# Altium schematic sheet hierarchy.SchDoc
size A3; DocumentNumber: 1; SheetNumber: 1; SheetTotal: 24; SheetDescription: Structure of Master
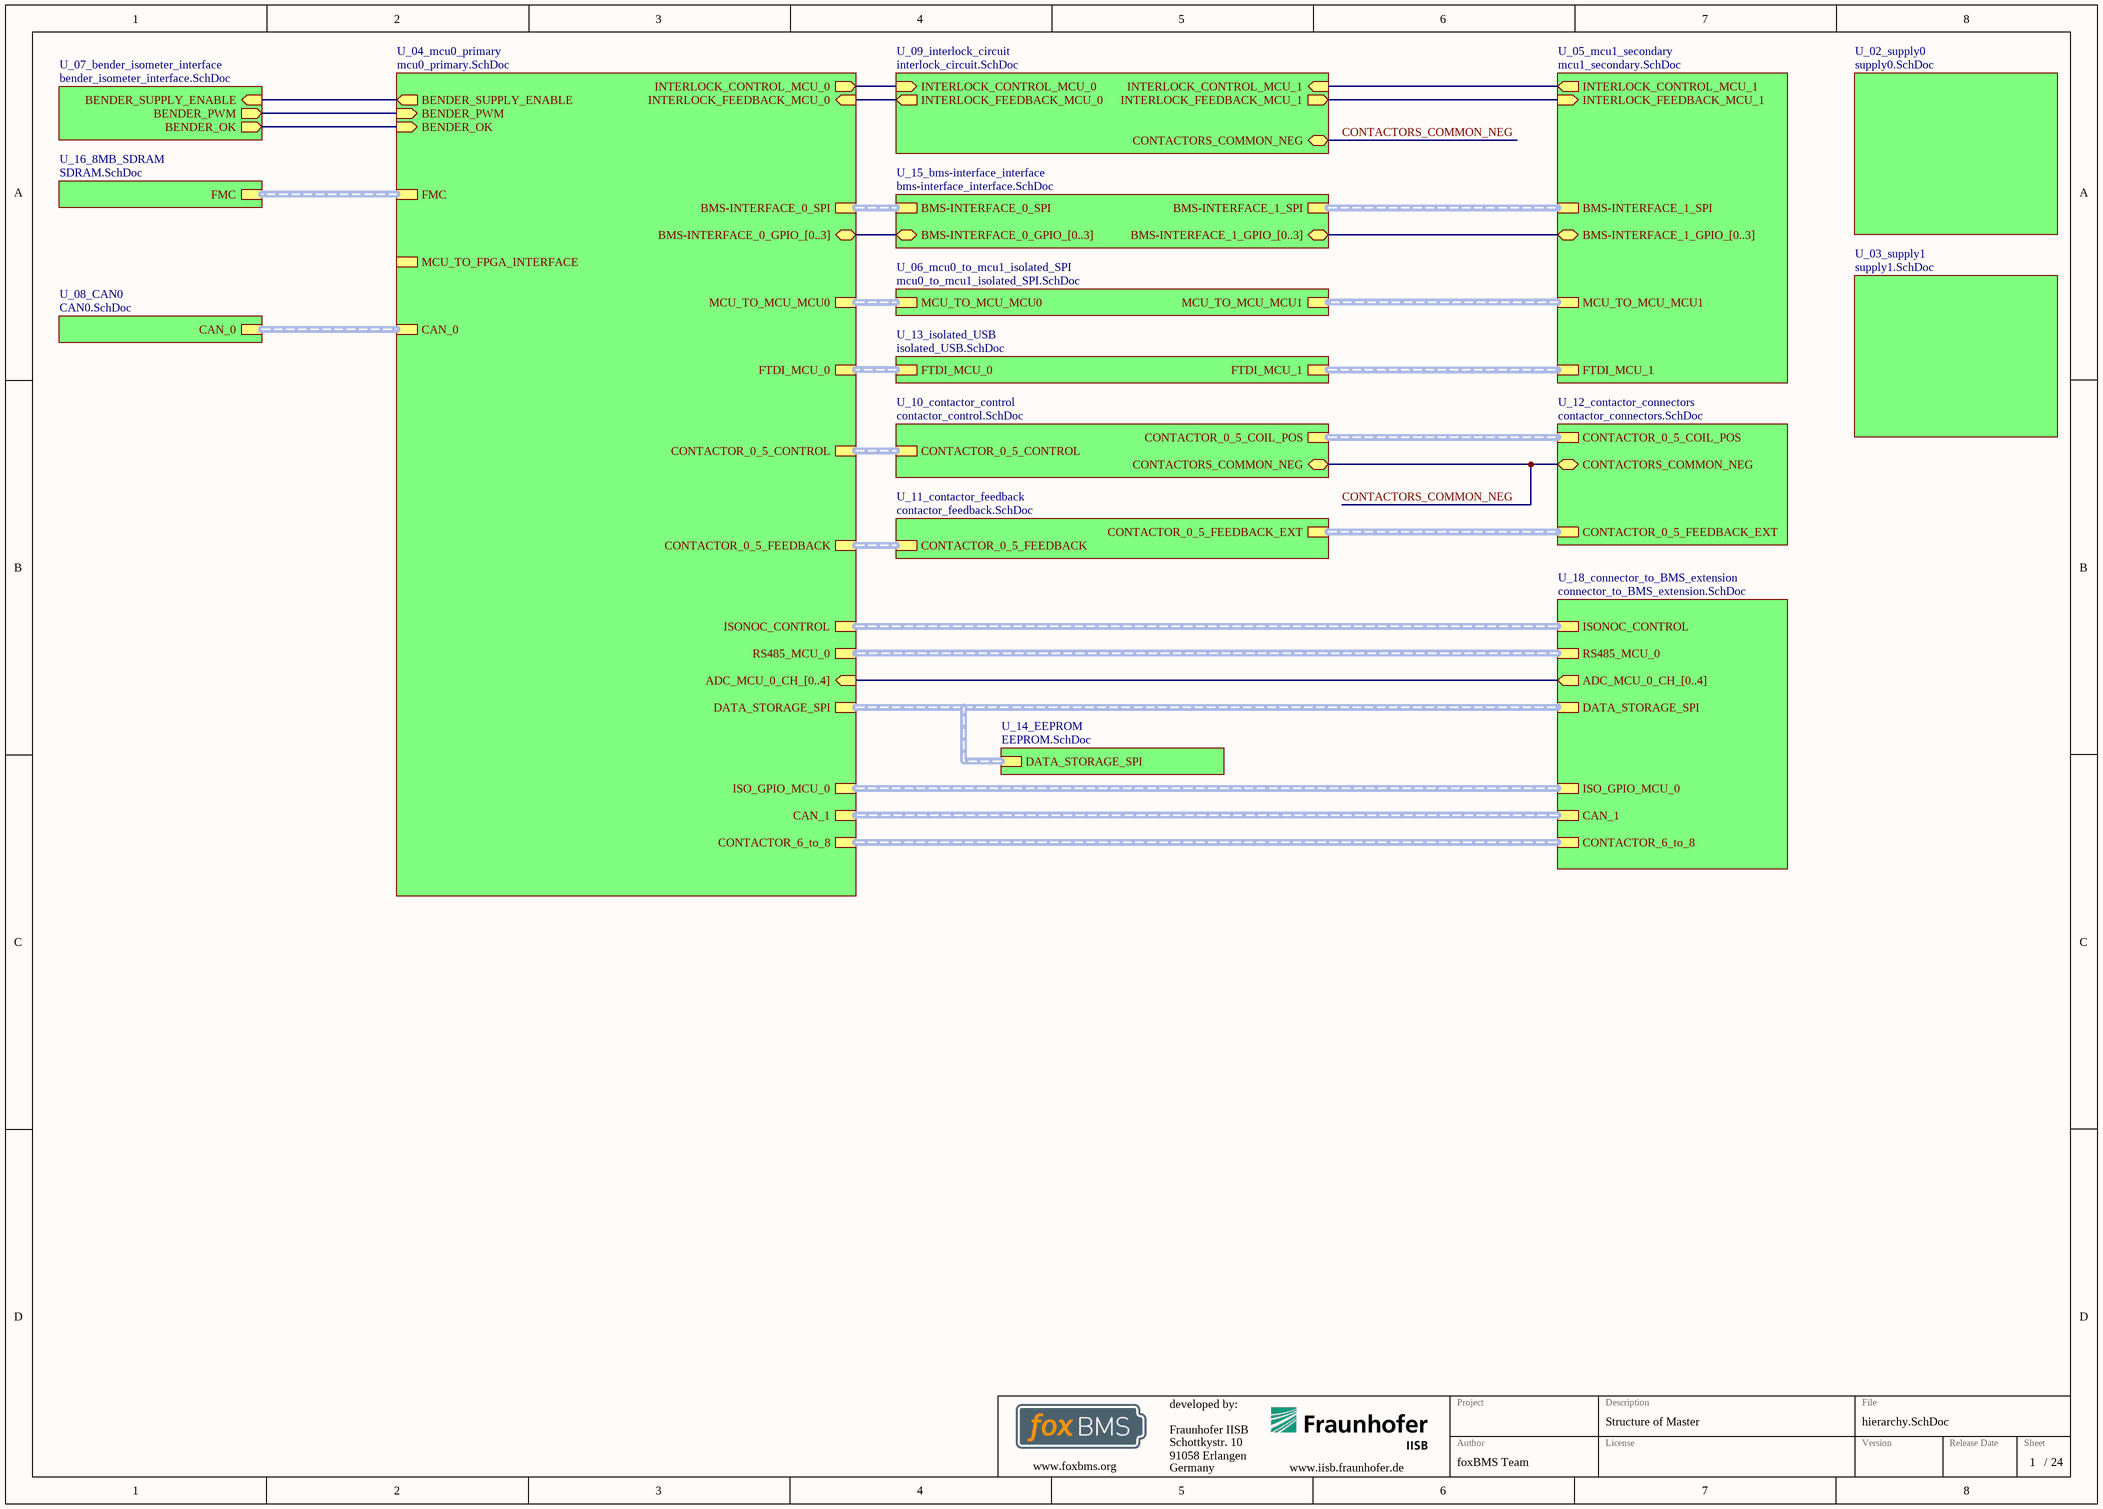
[diagram p0: hierarchy.SchDoc]

## Sub-sheets
U_02_supply0 = supply0.SchDoc: no entries
U_03_supply1 = supply1.SchDoc: no entries
U_04_mcu0_primary = mcu0_primary.SchDoc: MCU_TO_FPGA_INTERFACE (harness SPI), FMC (harness FMC), CAN_1 (harness CAN), CAN_0 (harness CAN), MCU_TO_MCU_MCU0 (harness SPI), BENDER_SUPPLY_ENABLE (out), BENDER_PWM (in), BENDER_OK (in), FTDI_MCU_0 (harness FTDI), CONTACTOR_6_to_8 (harness CONTACTOR_6_to_8), INTERLOCK_FEEDBACK_MCU_0 (in), INTERLOCK_CONTROL_MCU_0 (out), DATA_STORAGE_SPI (harness DATA_STORAGE_SPI), CONTACTOR_0_5_FEEDBACK (harness CONTACTOR_0_TO_5), CONTACTOR_0_5_CONTROL (harness CONTACTOR_0_TO_5), BMS-INTERFACE_0_SPI (harness SPI), BMS-INTERFACE_0_GPIO_[0..3] (bidir, harness CAN), ADC_MCU_0_CH_[0..4] (in), RS485_MCU_0 (harness RS485), ISONOC_CONTROL (harness ISONOC_CONTROL), ISO_GPIO_MCU_0 (harness ISO_GPIO)
U_05_mcu1_secondary = mcu1_secondary.SchDoc: INTERLOCK_FEEDBACK_MCU_1 (in), INTERLOCK_CONTROL_MCU_1 (out), FTDI_MCU_1 (harness FTDI), MCU_TO_MCU_MCU1 (harness SPI), BMS-INTERFACE_1_SPI (harness SPI), BMS-INTERFACE_1_GPIO_[0..3] (bidir)
U_06_mcu0_to_mcu1_isolated_SPI = mcu0_to_mcu1_isolated_SPI.SchDoc: MCU_TO_MCU_MCU0 (harness SPI), MCU_TO_MCU_MCU1 (harness SPI)
U_07_bender_isometer_interface = bender_isometer_interface.SchDoc: BENDER_SUPPLY_ENABLE (in), BENDER_OK (out), BENDER_PWM (out)
U_08_CAN0 = CAN0.SchDoc: CAN_0 (harness CAN)
U_09_interlock_circuit = interlock_circuit.SchDoc: INTERLOCK_CONTROL_MCU_1 (in), INTERLOCK_FEEDBACK_MCU_0 (out), INTERLOCK_FEEDBACK_MCU_1 (out), CONTACTORS_COMMON_NEG (bidir), INTERLOCK_CONTROL_MCU_0 (in)
U_10_contactor_control = contactor_control.SchDoc: CONTACTORS_COMMON_NEG (bidir), CONTACTOR_0_5_COIL_POS (harness CONTACTOR_0_TO_5), CONTACTOR_0_5_CONTROL (harness CONTACTOR_0_TO_5)
U_11_contactor_feedback = contactor_feedback.SchDoc: CONTACTOR_0_5_FEEDBACK_EXT (harness CONTACTOR_0_TO_5), CONTACTOR_0_5_FEEDBACK (harness CONTACTOR_0_TO_5)
U_12_contactor_connectors = contactor_connectors.SchDoc: CONTACTORS_COMMON_NEG (bidir), CONTACTOR_0_5_COIL_POS (harness CONTACTOR_0_TO_5), CONTACTOR_0_5_FEEDBACK_EXT (harness CONTACTOR_0_TO_5)
U_13_isolated_USB = isolated_USB.SchDoc: FTDI_MCU_0 (harness FTDI), FTDI_MCU_1 (harness FTDI)
U_14_EEPROM = EEPROM.SchDoc: DATA_STORAGE_SPI (harness DATA_STORAGE_SPI)
U_15_bms-interface_interface = bms-interface_interface.SchDoc: BMS-INTERFACE_0_SPI (harness SPI), BMS-INTERFACE_1_SPI (harness SPI), BMS-INTERFACE_0_GPIO_[0..3] (bidir), BMS-INTERFACE_1_GPIO_[0..3] (bidir)
U_16_8MB_SDRAM = SDRAM.SchDoc: FMC (harness FMC)
U_18_connector_to_BMS_extension = connector_to_BMS_extension.SchDoc: CAN_1 (harness CAN), CONTACTOR_6_to_8 (harness CONTACTOR_6_to_8), DATA_STORAGE_SPI (harness DATA_STORAGE_SPI), ADC_MCU_0_CH_[0..4] (out), RS485_MCU_0 (harness RS485), ISONOC_CONTROL (harness ISONOC_CONTROL), ISO_GPIO_MCU_0 (harness ISO_GPIO)

## Nets
CONTACTORS_COMMON_NEG: sheet U_09_interlock_circuit/CONTACTORS_COMMON_NEG, sheet U_10_contactor_control/CONTACTORS_COMMON_NEG, sheet U_12_contactor_connectors/CONTACTORS_COMMON_NEG
(unnamed): sheet U_04_mcu0_primary/BENDER_SUPPLY_ENABLE, sheet U_07_bender_isometer_interface/BENDER_SUPPLY_ENABLE
(unnamed): sheet U_04_mcu0_primary/BENDER_PWM, sheet U_07_bender_isometer_interface/BENDER_PWM
(unnamed): sheet U_04_mcu0_primary/BENDER_OK, sheet U_07_bender_isometer_interface/BENDER_OK
(unnamed): sheet U_04_mcu0_primary/INTERLOCK_FEEDBACK_MCU_0, sheet U_09_interlock_circuit/INTERLOCK_FEEDBACK_MCU_0
(unnamed): sheet U_04_mcu0_primary/INTERLOCK_CONTROL_MCU_0, sheet U_09_interlock_circuit/INTERLOCK_CONTROL_MCU_0
(unnamed): sheet U_05_mcu1_secondary/INTERLOCK_FEEDBACK_MCU_1, sheet U_09_interlock_circuit/INTERLOCK_FEEDBACK_MCU_1
(unnamed): sheet U_05_mcu1_secondary/INTERLOCK_CONTROL_MCU_1, sheet U_09_interlock_circuit/INTERLOCK_CONTROL_MCU_1

## Buses and harness runs
bus sheet U_04_mcu0_primary/ADC_MCU_0_CH_[0..4] = sheet U_18_connector_to_BMS_extension/ADC_MCU_0_CH_[0..4]
bus sheet U_05_mcu1_secondary/BMS-INTERFACE_1_GPIO_[0..3] = sheet U_15_bms-interface_interface/BMS-INTERFACE_1_GPIO_[0..3]
harness sheet U_04_mcu0_primary/BMS-INTERFACE_0_SPI = sheet U_15_bms-interface_interface/BMS-INTERFACE_0_SPI
harness sheet U_04_mcu0_primary/CAN_0 = sheet U_08_CAN0/CAN_0
harness sheet U_04_mcu0_primary/CAN_1 = sheet U_18_connector_to_BMS_extension/CAN_1
harness sheet U_04_mcu0_primary/CONTACTOR_0_5_CONTROL = sheet U_10_contactor_control/CONTACTOR_0_5_CONTROL
harness sheet U_04_mcu0_primary/CONTACTOR_0_5_FEEDBACK = sheet U_11_contactor_feedback/CONTACTOR_0_5_FEEDBACK
harness sheet U_04_mcu0_primary/CONTACTOR_6_to_8 = sheet U_18_connector_to_BMS_extension/CONTACTOR_6_to_8
harness sheet U_04_mcu0_primary/DATA_STORAGE_SPI = sheet U_14_EEPROM/DATA_STORAGE_SPI = sheet U_18_connector_to_BMS_extension/DATA_STORAGE_SPI
harness sheet U_04_mcu0_primary/FMC = sheet U_16_8MB_SDRAM/FMC
harness sheet U_04_mcu0_primary/FTDI_MCU_0 = sheet U_13_isolated_USB/FTDI_MCU_0
harness sheet U_04_mcu0_primary/ISO_GPIO_MCU_0 = sheet U_18_connector_to_BMS_extension/ISO_GPIO_MCU_0
harness sheet U_04_mcu0_primary/ISONOC_CONTROL = sheet U_18_connector_to_BMS_extension/ISONOC_CONTROL
harness sheet U_04_mcu0_primary/MCU_TO_MCU_MCU0 = sheet U_06_mcu0_to_mcu1_isolated_SPI/MCU_TO_MCU_MCU0
harness sheet U_04_mcu0_primary/RS485_MCU_0 = sheet U_18_connector_to_BMS_extension/RS485_MCU_0
harness sheet U_05_mcu1_secondary/BMS-INTERFACE_1_SPI = sheet U_15_bms-interface_interface/BMS-INTERFACE_1_SPI
harness sheet U_05_mcu1_secondary/FTDI_MCU_1 = sheet U_13_isolated_USB/FTDI_MCU_1
harness sheet U_05_mcu1_secondary/MCU_TO_MCU_MCU1 = sheet U_06_mcu0_to_mcu1_isolated_SPI/MCU_TO_MCU_MCU1
harness sheet U_10_contactor_control/CONTACTOR_0_5_COIL_POS = sheet U_12_contactor_connectors/CONTACTOR_0_5_COIL_POS
harness sheet U_11_contactor_feedback/CONTACTOR_0_5_FEEDBACK_EXT = sheet U_12_contactor_connectors/CONTACTOR_0_5_FEEDBACK_EXT

## Notes on the sheet
- Fraunhofer IISB
- Schottkystr. 10
- developed by:
- 91058 Erlangen
- Germany
- Author
- Project
- License
- Description
- File
- Version
- Release Date
- Sheet
- www.foxbms.org
- www.iisb.fraunhofer.de
- foxBMS Team
- /